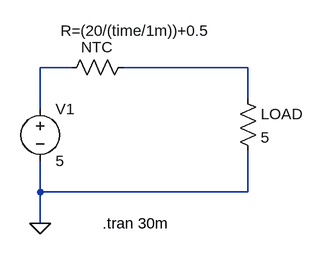
[diagram p0: schematic TimeDependentResistor3.asc]
TimeDependentResistor3.asc, the LTspice schematic file:
Version 4.1
SHEET 1 880 680
WIRE 0 144 -48 144
WIRE 272 144 80 144
WIRE 272 192 272 144
WIRE -48 208 -48 144
WIRE -48 336 -48 288
WIRE 272 336 272 272
WIRE 272 336 -48 336
WIRE -48 384 -48 336
FLAG -48 384 0
SYMBOL voltage -48 192 R0
WINDOW 123 0 0 Left 0
WINDOW 39 0 0 Left 0
SYMATTR InstName V1
SYMATTR Value 5
SYMBOL res 256 176 R0
SYMATTR InstName LOAD
SYMATTR Value 5
SYMBOL res 96 128 R90
WINDOW 0 0 56 VBottom 2
WINDOW 3 -56 -4 VTop 2
SYMATTR InstName NTC
SYMATTR Value R=(20/(time/1m))+0.5
TEXT 48 384 Left 2 !.tran 30m

The netlist it stands for:
* TimeDependentResistor3.asc
V1 N001 0 5
R§LOAD N002 0 5
R§NTC N002 N001 R=(20/(time/1m))+0.5
.tran 30m
.backanno
.end